# Altium schematic sheet sodonguyenly.SchDoc
size A; SheetNumber: 1; SheetTotal: 2
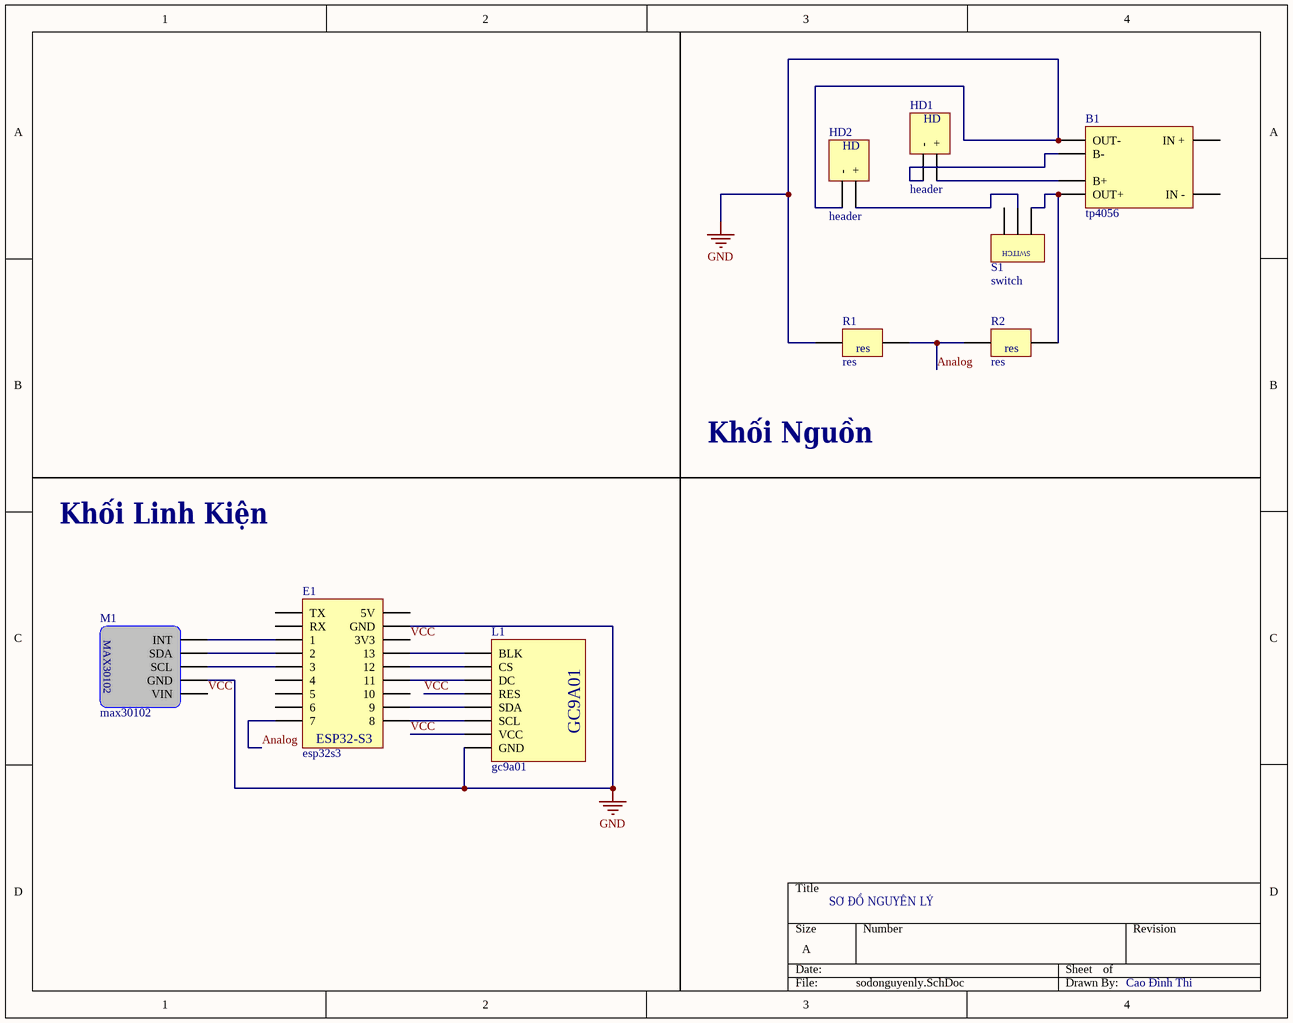
[diagram p0: sodonguyenly.SchDoc]

## Parts
B1  tp4056  [tp4056]
E1  esp32s3  [esp32s3]
HD1  header  [header]
HD2  header  [header]
L1  gc9a01  [gc9a01]
M1  max30102  [max30102]
R1  res  [res]
R2  res  [res]
S1  switch  [switch]

## Nets
GND: B1.2(OUT-) E1.16(GND) HD2.0(-) L1.0(GND) M1.3(GND) R1.0
Analog: E1.8(7) R1.1 R2.0
VCC: E1.15(3V3) L1.1(VCC) L1.4(RES) M1.4(VIN)
NetB1_3: B1.3(B-) HD1.0(-)
NetB1_4: B1.4(B+) HD1.1(+)
NetB1_5: B1.5(OUT+) R2.1 S1.0
NetE1_2: E1.2(1) M1.0(INT)
NetE1_3: E1.3(2) M1.1(SDA)
NetE1_4: E1.4(3) M1.2(SCL)
NetE1_9: E1.9(8) L1.2(SCL)
NetE1_10: E1.10(9) L1.3(SDA)
NetE1_12: E1.12(11) L1.5(DC)
NetE1_13: E1.13(12) L1.6(CS)
NetE1_14: E1.14(13) L1.7(BLK)
NetHD2_1: HD2.1(+) S1.1

Not connected (* = marked no-connect by the designer): B1 0(IN_+) 1(IN_-); E1 0(TX) 1(RX) 5(4) 6(5) 7(6) 11(10) 17(5V); S1 2

## Notes on the sheet
- Khối Nguồn
- Khối Linh Kiện
- SƠ ĐỒ NGUYÊN LÝ
- Cao Đình Thi
- (in symbol esp32s3) ESP32-S3
- (in symbol gc9a01) GC9A01
- (in symbol header) HD
- (in symbol max30102) MAX30102
- (in symbol switch) SWITCH